# EAGLE schematic evm (EAGLE 9.6.2)
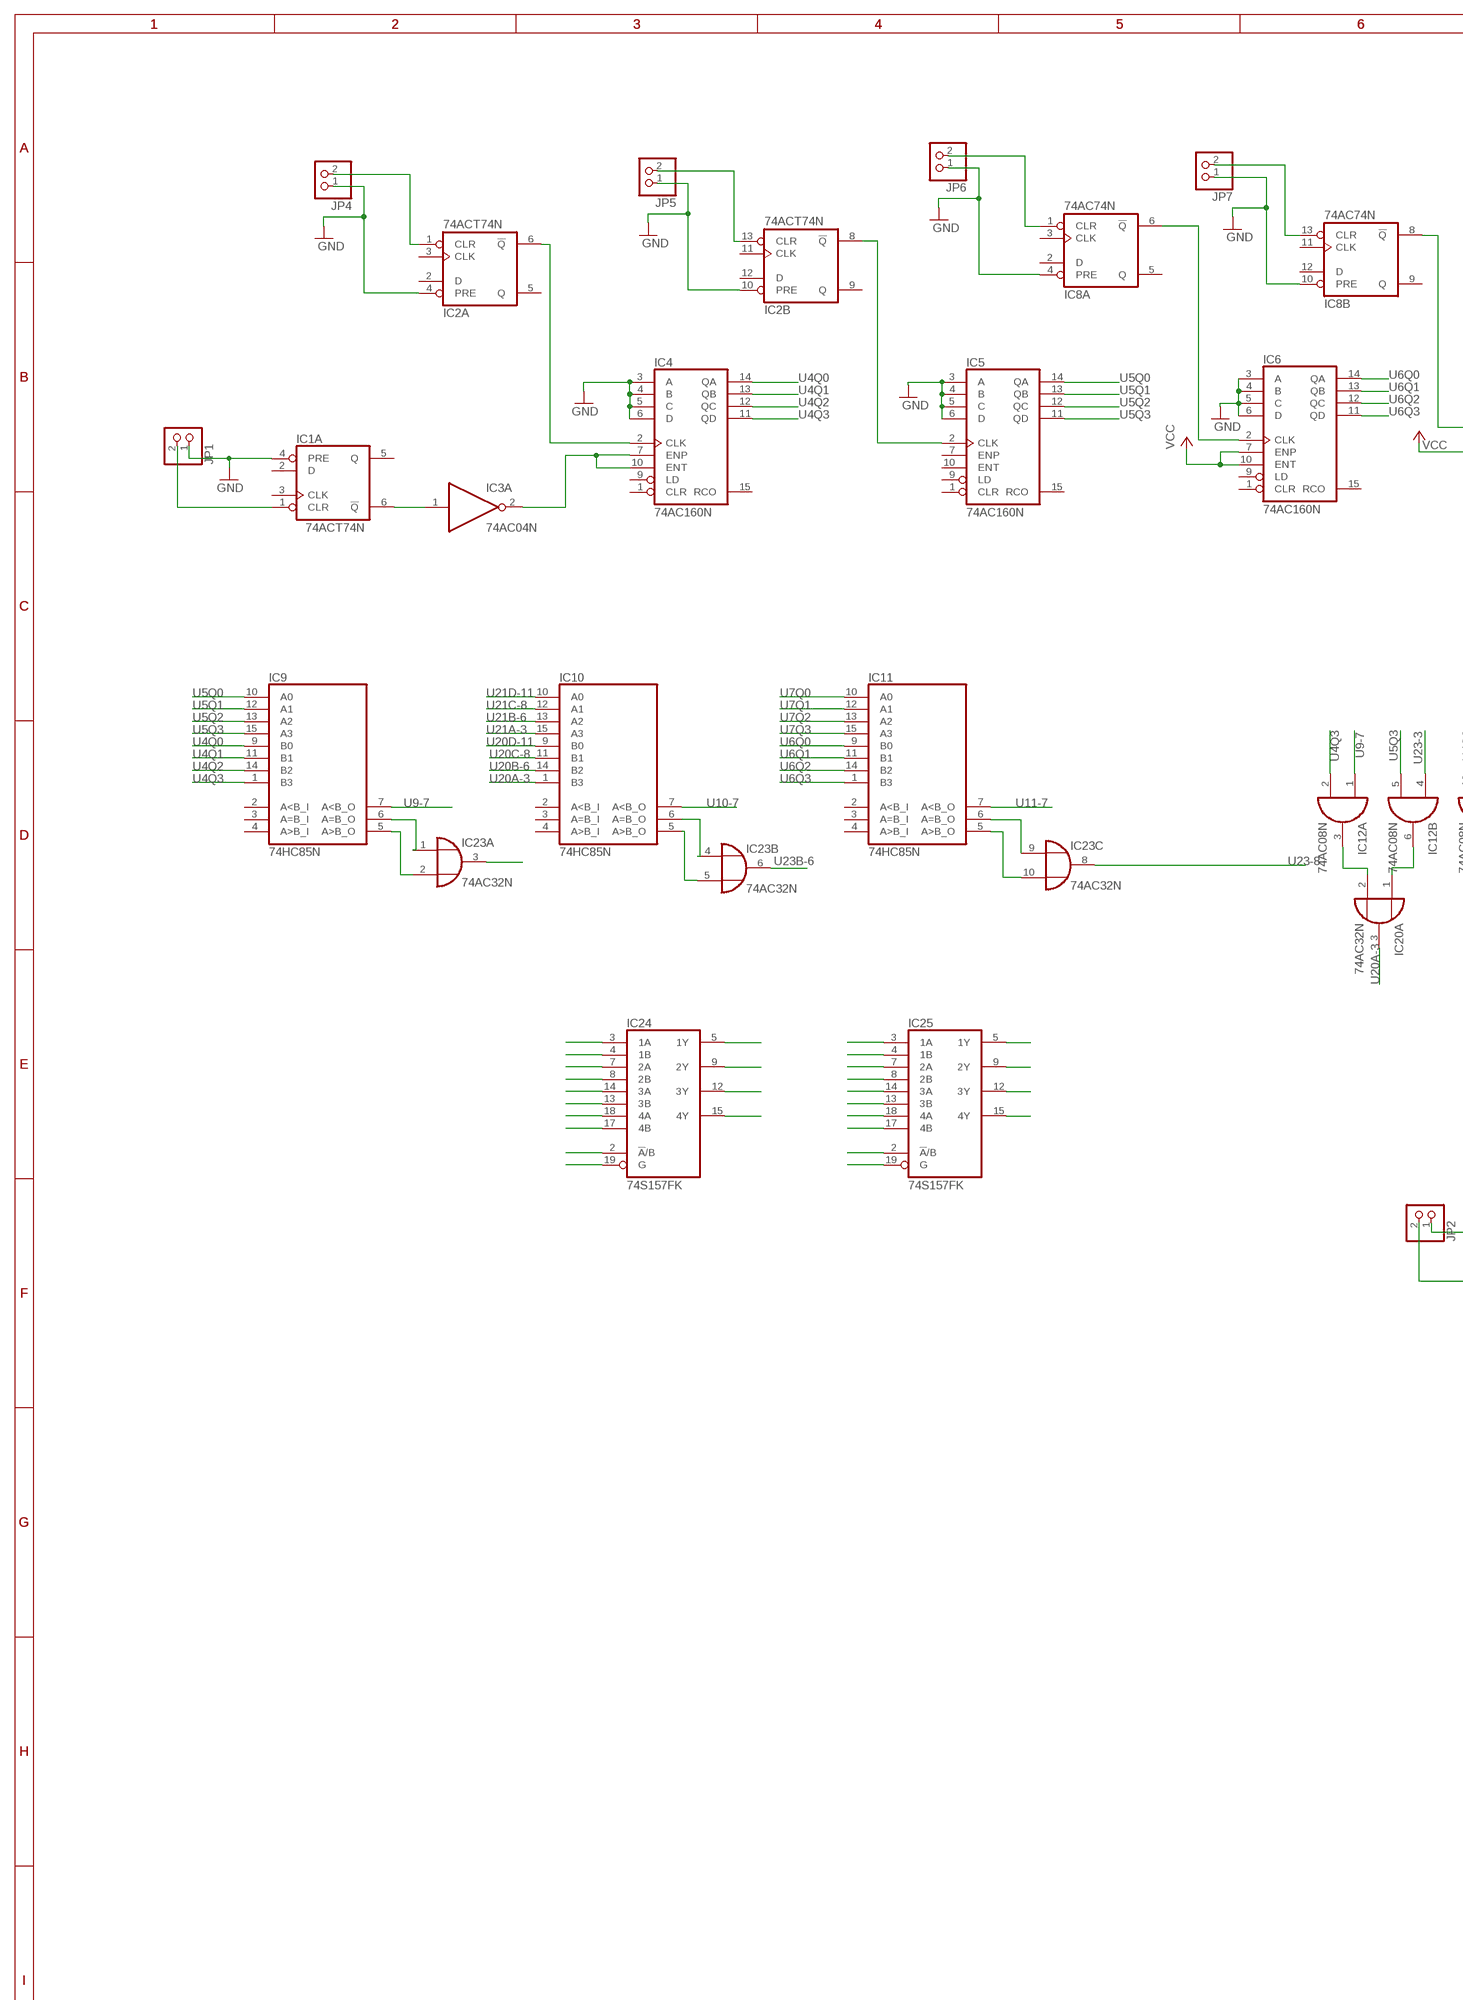
[diagram p0: schematic, sheet 1, part 1 of 2]
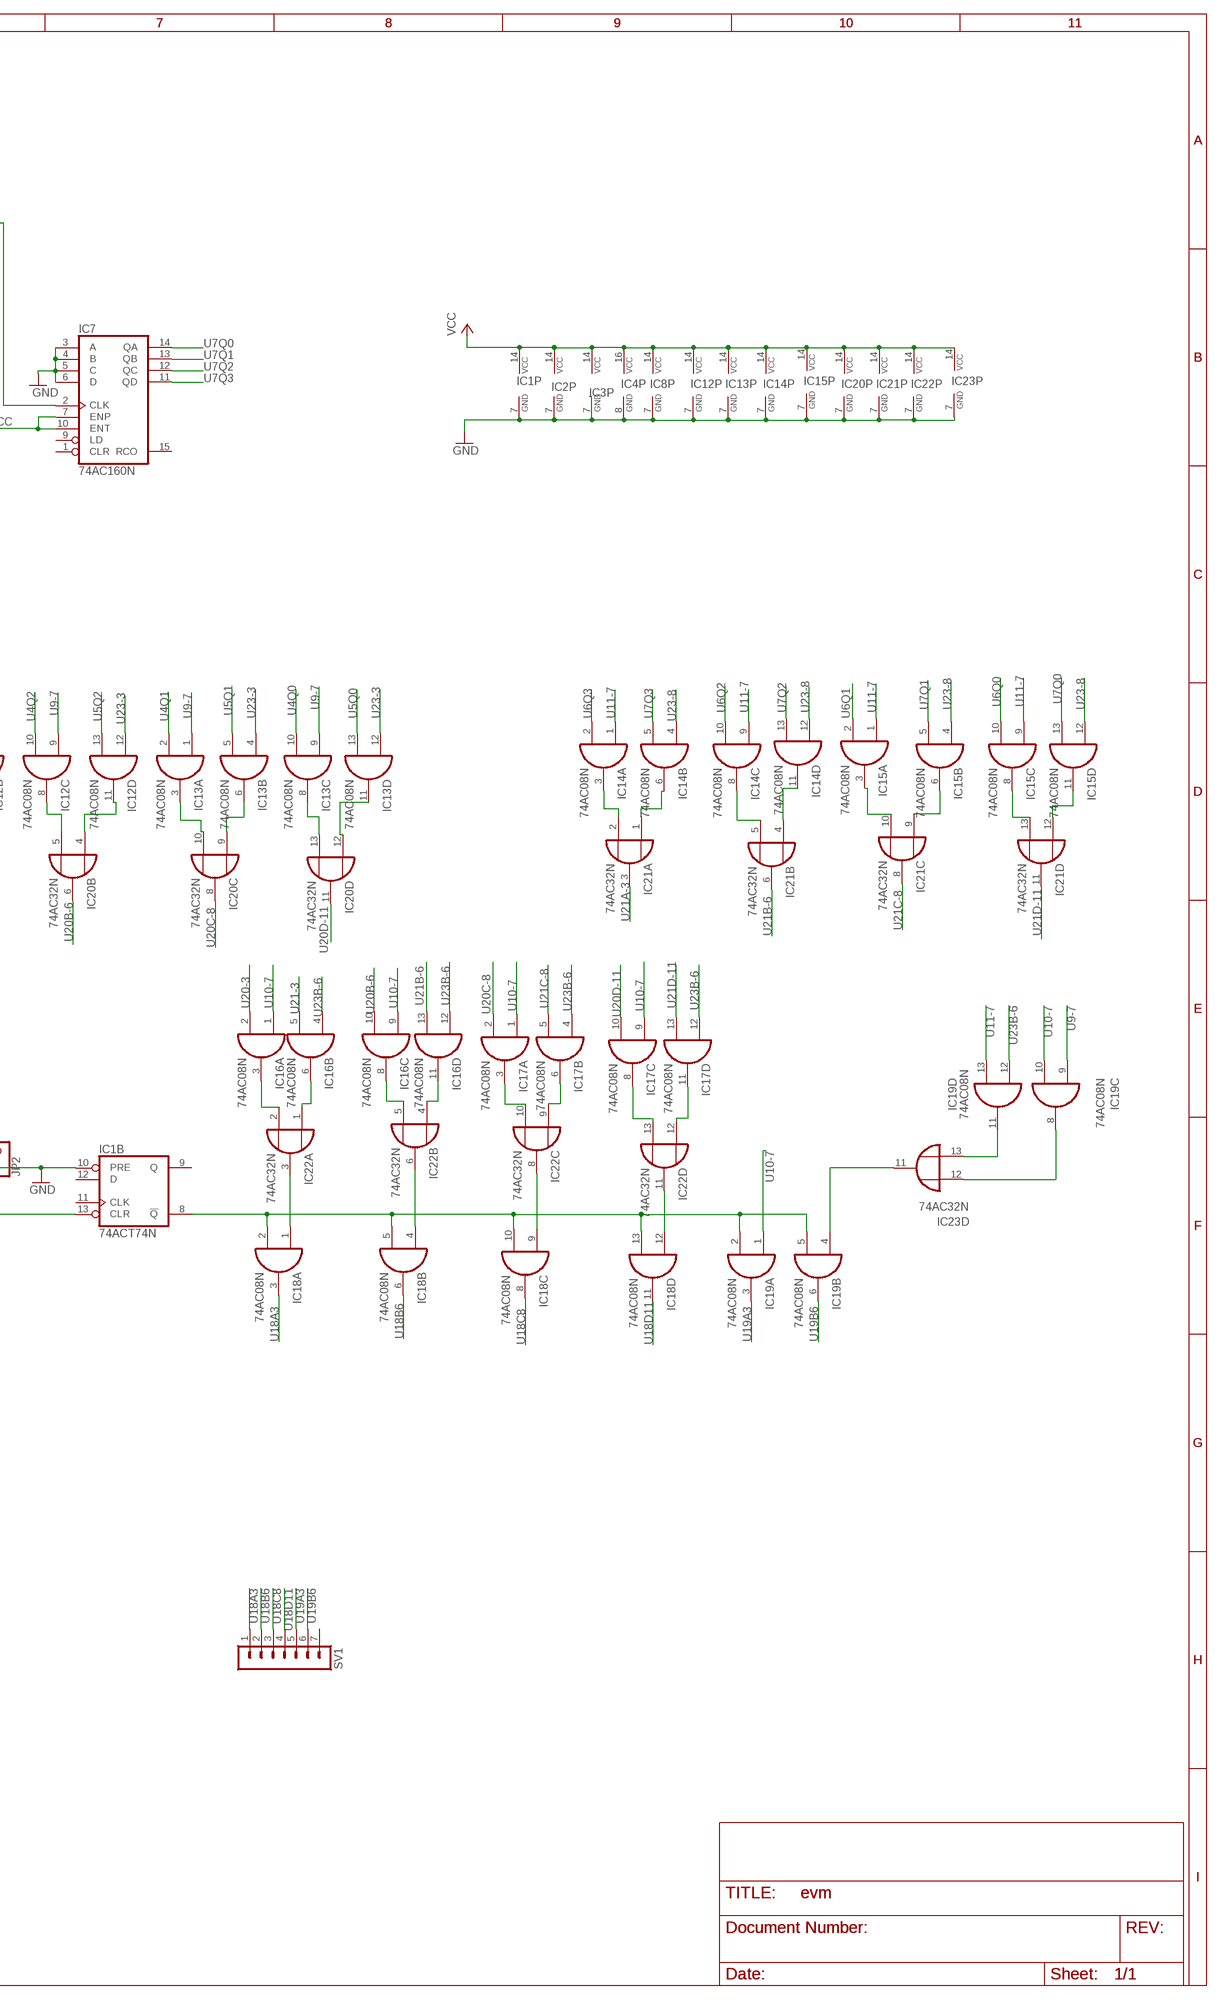
[diagram p1: schematic, sheet 1, part 2 of 2]

## Parts
IC1  74ACT74N  [DIL14]
IC2  74ACT74N  [DIL14]
IC3  74AC04N  [DIL14]
IC4  74AC160N  [DIL16]
IC5  74AC160N  [DIL16]
IC6  74AC160N  [DIL16]
IC7  74AC160N  [DIL16]
IC8  74AC74N  [DIL14]
IC9  74HC85N  [DIL16]
IC10  74HC85N  [DIL16]
IC11  74HC85N  [DIL16]
IC12  74AC08N  [DIL14]
IC13  74AC08N  [DIL14]
IC14  74AC08N  [DIL14]
IC15  74AC08N  [DIL14]
IC16  74AC08N  [DIL14]
IC17  74AC08N  [DIL14]
IC18  74AC08N  [DIL14]
IC19  74AC08N  [DIL14]
IC20  74AC32N  [DIL14]
IC21  74AC32N  [DIL14]
IC22  74AC32N  [DIL14]
IC23  74AC32N  [DIL14]
IC24  74S157FK  [LCC20]
IC25  74S157FK  [LCC20]
JP1  PINHD-1X2  [1X02]
JP2  PINHD-1X2  [1X02]
JP4  PINHD-1X2  [1X02]
JP5  PINHD-1X2  [1X02]
JP6  PINHD-1X2  [1X02]
JP7  PINHD-1X2  [1X02]
SV1  MA07-1  [MA07-1]

## Nets
GND: IC1.4(A:PRE) IC1.7(P:GND) IC1.10(B:PRE) IC2.4(A:PRE) IC2.7(P:GND) IC2.10(B:PRE) IC3.7(P:GND) IC4.3(A) IC4.4(B) IC4.5(C) IC4.6(D) IC4.8(GND) IC5.3(A) IC5.4(B) IC5.5(C) IC5.6(D) IC6.3(A) IC6.4(B) IC6.5(C) IC6.6(D) IC7.3(A) IC7.4(B) IC7.5(C) IC7.6(D) IC8.4(A:PRE) IC8.7(P:GND) IC8.10(B:PRE) IC12.7(P:GND) IC13.7(P:GND) IC14.7(P:GND) IC15.7(P:GND) IC20.7(P:GND) IC21.7(P:GND) IC22.7(P:GND) IC23.7(P:GND) JP1.1 JP2.1 JP4.1 JP5.1 JP6.1 JP7.1
N$1: IC1.13(B:CLR) JP2.2
N$2: IC1.6(A:!Q) IC3.1(A:I)
N$3: IC1.1(A:CLR) JP1.2
N$4: IC3.2(A:O) IC4.7(ENP) IC4.10(ENT)
N$5: IC2.6(A:!Q) IC4.2(CLK)
N$6: IC2.1(A:CLR) JP4.2
N$7: IC16.3(A:O) IC22.2(A:I1)
N$8: IC18.1(A:I0) IC22.3(A:O)
N$9: IC18.4(B:I0) IC22.6(B:O)
N$10: IC16.6(B:O) IC22.1(A:I0)
N$11: IC2.13(B:CLR) JP5.2
N$12: IC2.8(B:!Q) IC5.2(CLK)
N$13: IC6.2(CLK) IC8.6(A:!Q)
N$14: IC8.1(A:CLR) JP6.2
N$15: IC16.8(C:O) IC22.5(B:I1)
N$16: IC16.11(D:O) IC22.4(B:I0)
N$17: IC17.3(A:O) IC22.10(C:I1)
N$18: IC17.6(B:O) IC22.9(C:I0)
N$19: IC7.2(CLK) IC8.8(B:!Q)
N$20: IC8.13(B:CLR) JP7.2
N$21: IC9.6(A=B_O) IC23.1(A:I0)
N$22: IC12.3(A:O) IC20.2(A:I1)
N$23: IC9.5(A>B_O) IC23.2(A:I1)
N$24: IC11.6(A=B_O) IC23.9(C:I0)
N$25: IC12.6(B:O) IC20.1(A:I0)
N$26: IC12.8(C:O) IC20.5(B:I1)
N$27: IC12.11(D:O) IC20.4(B:I0)
N$28: IC13.3(A:O) IC20.10(C:I1)
N$29: IC13.6(B:O) IC20.9(C:I0)
N$30: IC13.8(C:O) IC20.13(D:I1)
N$31: IC13.11(D:O) IC20.12(D:I0)
N$32: IC14.3(A:O) IC21.2(A:I1)
N$33: IC23.3(A:O)
N$34: IC11.5(A>B_O) IC23.10(C:I1)
N$35: IC14.6(B:O) IC21.1(A:I0)
N$36: IC14.8(C:O) IC21.5(B:I1)
N$37: IC14.11(D:O) IC21.4(B:I0)
N$38: IC15.3(A:O) IC21.10(C:I1)
N$39: IC15.6(B:O) IC21.9(C:I0)
N$40: IC15.8(C:O) IC21.13(D:I1)
N$41: IC15.11(D:O) IC21.12(D:I0)
N$42: IC10.6(A=B_O) IC23.4(B:I0)
N$43: IC17.8(C:O) IC22.13(D:I1)
N$44: IC10.5(A>B_O) IC23.5(B:I1)
N$45: IC17.11(D:O) IC22.12(D:I0)
N$46: IC18.12(D:I0) IC22.11(D:O)
N$47: IC1.8(B:!Q) IC18.2(A:I1) IC18.5(B:I1) IC18.10(C:I1) IC18.13(D:I1) IC19.2(A:I1) IC19.5(B:I1)
N$48: IC19.4(B:I0) IC23.11(D:O)
N$49: IC19.11(D:O) IC23.13(D:I1)
N$50: IC19.8(C:O) IC23.12(D:I0)
N$51: IC24.3(1A)
N$52: IC24.4(1B)
N$53: IC24.7(2A)
N$54: IC18.9(C:I0) IC22.8(C:O)
N$55: IC24.8(2B)
N$56: IC24.14(3A)
N$57: IC24.13(3B)
N$58: IC24.18(4A)
N$59: IC24.17(4B)
N$60: IC24.5(1Y)
N$61: IC24.9(2Y)
N$62: IC24.12(3Y)
N$63: IC24.15(4Y)
N$64: IC24.2(!A!/B)
N$65: IC24.19(G)
N$66: IC25.3(1A)
N$67: IC25.4(1B)
N$68: IC25.7(2A)
N$69: IC25.8(2B)
N$70: IC25.14(3A)
N$71: IC25.13(3B)
N$72: IC25.18(4A)
N$73: IC25.17(4B)
N$74: IC25.2(!A!/B)
N$75: IC25.19(G)
N$76: IC25.5(1Y)
N$77: IC25.9(2Y)
N$78: IC25.12(3Y)
N$79: IC25.15(4Y)
U4Q0: IC4.14(QA) IC9.9(B0) IC13.10(C:I1)
U4Q1: IC4.13(QB) IC9.11(B1) IC13.2(A:I1)
U4Q2: IC4.12(QC) IC9.14(B2) IC12.10(C:I1)
U4Q3: IC4.11(QD) IC9.1(B3) IC12.2(A:I1)
U5Q0: IC5.14(QA) IC9.10(A0) IC13.13(D:I1)
U5Q1: IC5.13(QB) IC9.12(A1) IC13.5(B:I1)
U5Q2: IC5.12(QC) IC9.13(A2) IC12.13(D:I1)
U5Q3: IC5.11(QD) IC9.15(A3) IC12.5(B:I1)
U6Q0: IC6.14(QA) IC11.9(B0) IC15.10(C:I1)
U6Q1: IC6.13(QB) IC11.11(B1) IC15.2(A:I1)
U6Q2: IC6.12(QC) IC11.14(B2) IC14.10(C:I1)
U6Q3: IC6.11(QD) IC11.1(B3) IC14.2(A:I1)
U7Q0: IC7.14(QA) IC11.10(A0) IC15.13(D:I1)
U7Q1: IC7.13(QB) IC11.12(A1) IC15.5(B:I1)
U7Q2: IC7.12(QC) IC11.13(A2) IC14.13(D:I1)
U7Q3: IC7.11(QD) IC11.15(A3) IC14.5(B:I1)
U9-7: IC9.7(A<B_O) IC12.1(A:I0) IC12.9(C:I0) IC13.1(A:I0) IC13.9(C:I0) IC19.9(C:I0)
U10-7: IC10.7(A<B_O) IC16.1(A:I0) IC16.9(C:I0) IC17.1(A:I0) IC17.9(C:I0) IC19.1(A:I0) IC19.10(C:I1)
U11-7: IC11.7(A<B_O) IC14.1(A:I0) IC14.9(C:I0) IC15.1(A:I0) IC15.9(C:I0) IC19.13(D:I1)
U18A3: IC18.3(A:O) SV1.1
U18B6: IC18.6(B:O) SV1.2
U18C8: IC18.8(C:O) SV1.3
U18D11: IC18.11(D:O) SV1.4
U19A3: IC19.3(A:O) SV1.5
U19B6: IC19.6(B:O) SV1.6
U20-3: IC16.2(A:I1)
U20A-3: IC10.1(B3) IC20.3(A:O)
U20B-6: IC10.14(B2) IC16.10(C:I1) IC20.6(B:O)
U20C-8: IC10.11(B1) IC17.2(A:I1) IC20.8(C:O)
U20D-11: IC10.9(B0) IC17.10(C:I1) IC20.11(D:O)
U21-3: IC16.5(B:I1)
U21A-3: IC10.15(A3) IC21.3(A:O)
U21B-6: IC10.13(A2) IC16.13(D:I1) IC21.6(B:O)
U21C-8: IC10.12(A1) IC17.5(B:I1) IC21.8(C:O)
U21D-11: IC10.10(A0) IC17.13(D:I1) IC21.11(D:O)
U23-3: IC12.4(B:I0) IC12.12(D:I0) IC13.4(B:I0) IC13.12(D:I0)
U23-8: IC14.4(B:I0) IC14.12(D:I0) IC15.4(B:I0) IC15.12(D:I0) IC23.8(C:O)
U23B-6: IC16.4(B:I0) IC16.12(D:I0) IC17.4(B:I0) IC17.12(D:I0) IC19.12(D:I0) IC23.6(B:O)
VCC: IC1.14(P:VCC) IC2.14(P:VCC) IC3.14(P:VCC) IC4.16(VCC) IC6.7(ENP) IC6.10(ENT) IC8.14(P:VCC) IC12.14(P:VCC) IC13.14(P:VCC) IC14.14(P:VCC) IC15.14(P:VCC) IC20.14(P:VCC) IC21.14(P:VCC) IC22.14(P:VCC) IC23.14(P:VCC)
VCC1: IC7.7(ENP) IC7.10(ENT)
Unconnected: IC1.2(A:D) IC1.3(A:CLK) IC1.5(A:Q) IC1.9(B:Q) IC1.11(B:CLK) IC1.12(B:D) IC2.2(A:D) IC2.3(A:CLK) IC2.5(A:Q) IC2.9(B:Q) IC2.11(B:CLK) IC2.12(B:D) IC3.3(B:I) IC3.4(B:O) IC3.5(C:I) IC3.6(C:O) IC3.8(D:O) IC3.9(D:I) IC3.10(E:O) IC3.11(E:I) IC3.12(F:O) IC3.13(F:I) IC4.1(CLR) IC4.9(LD) IC4.15(RCO) IC5.1(CLR) IC5.7(ENP) IC5.9(LD) IC5.10(ENT) IC5.15(RCO) IC6.1(CLR) IC6.9(LD) IC6.15(RCO) IC7.1(CLR) IC7.9(LD) IC7.15(RCO) IC8.2(A:D) IC8.3(A:CLK) IC8.5(A:Q) IC8.9(B:Q) IC8.11(B:CLK) IC8.12(B:D) IC9.2(A<B_I) IC9.3(A=B_I) IC9.4(A>B_I) IC10.2(A<B_I) IC10.3(A=B_I) IC10.4(A>B_I) IC11.2(A<B_I) IC11.3(A=B_I) IC11.4(A>B_I) SV1.7

## Power pins joined to a net without a drawn wire
GND: IC5.8(GND) IC6.8(GND) IC7.8(GND) IC9.8(GND) IC10.8(GND) IC11.8(GND) IC16.7(P:GND) IC17.7(P:GND) IC18.7(P:GND) IC19.7(P:GND) IC24.10(GND) IC25.10(GND)
VCC: IC5.16(VCC) IC6.16(VCC) IC7.16(VCC) IC9.16(VCC) IC10.16(VCC) IC11.16(VCC) IC16.14(P:VCC) IC17.14(P:VCC) IC18.14(P:VCC) IC19.14(P:VCC) IC24.20(VCC) IC25.20(VCC)

## Library data of the parts
IC1 IC2 IC8 = 74xx-eu:74*74: Dual D type positive edge triggered FLIP FLOP, preset and clear
IC3 = 74xx-eu:74*04: Hex INVERTER
IC4-IC7 = 74xx-eu:74*160: Synchronous 4-bit COUNTER
IC9-IC11 = 74xx-eu:74*85: 4-bit magnitude COMPARATOR
IC12-IC19 = 74xx-eu:74*08: Quad 2-input AND gate
IC20-IC23 = 74xx-eu:74*32: Quad 2-input OR gate
IC24 IC25 = 74xx-us:74*157: Quadruple 2-line to 1-line data SELECTOR/MULTIPLEXER
JP1 JP2 JP4-JP7 = pinhead:PINHD-1X2: PIN HEADER
SV1 = con-lstb:MA07-1: PIN HEADER; OC_FARNELL: unknown; OC_NEWARK: unknown